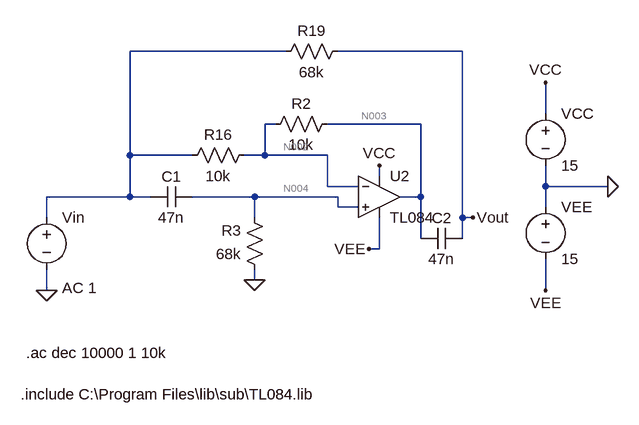
[diagram p0: schematic notch filter.asc]
notch filter.asc, the LTspice schematic file:
Version 4
SHEET 1 1128 680
WIRE 288 -80 48 -80
WIRE 560 -80 368 -80
WIRE 688 16 688 -32
WIRE 272 32 256 32
WIRE 496 32 352 32
WIRE 48 80 48 -80
WIRE 144 80 48 80
WIRE 256 80 256 32
WIRE 256 80 224 80
WIRE 352 80 256 80
WIRE 432 112 432 96
WIRE 352 128 352 80
WIRE 400 128 352 128
WIRE 688 128 688 96
WIRE 784 128 688 128
WIRE 48 144 48 80
WIRE 48 144 -80 144
WIRE 80 144 48 144
WIRE 240 144 144 144
WIRE 368 144 240 144
WIRE 496 144 496 32
WIRE 496 144 464 144
WIRE 368 160 368 144
WIRE 400 160 368 160
WIRE 688 160 688 128
WIRE -80 176 -80 144
WIRE 240 176 240 144
WIRE 560 176 560 -80
WIRE 576 176 560 176
WIRE 496 208 496 144
WIRE 560 208 560 176
WIRE 432 224 432 176
WIRE 432 224 416 224
WIRE 240 272 240 256
WIRE -80 288 -80 256
WIRE 688 288 688 240
FLAG 784 128 0
FLAG 240 272 0
FLAG -80 288 0
FLAG 688 -32 VCC
FLAG 432 96 VCC
FLAG 688 288 VEE
FLAG 416 224 VEE
FLAG 576 176 Vout
SYMBOL res 256 272 R180
WINDOW 0 36 76 Left 2
WINDOW 3 36 40 Left 2
SYMATTR InstName R3
SYMATTR Value 68k
SYMBOL res 368 16 R90
WINDOW 0 0 56 VBottom 2
WINDOW 3 32 56 VTop 2
SYMATTR InstName R2
SYMATTR Value 10k
SYMBOL cap 144 128 R90
WINDOW 0 0 32 VBottom 2
WINDOW 3 32 32 VTop 2
SYMATTR InstName C1
SYMATTR Value 47n
SYMBOL cap 560 192 R90
WINDOW 0 0 32 VBottom 2
WINDOW 3 32 32 VTop 2
SYMATTR InstName C2
SYMATTR Value 47n
SYMBOL voltage -80 160 R0
WINDOW 123 24 124 Left 2
WINDOW 39 0 0 Left 0
SYMATTR Value2 AC 1
SYMATTR InstName Vin
SYMATTR Value ""
SYMBOL voltage 688 144 R0
WINDOW 123 0 0 Left 0
WINDOW 39 0 0 Left 0
SYMATTR InstName VEE
SYMATTR Value 15
SYMBOL voltage 688 0 R0
WINDOW 123 0 0 Left 0
WINDOW 39 0 0 Left 0
SYMATTR InstName VCC
SYMATTR Value 15
SYMBOL res 240 64 R90
WINDOW 0 0 56 VBottom 2
WINDOW 3 32 56 VTop 2
SYMATTR InstName R16
SYMATTR Value 10k
SYMBOL res 384 -96 R90
WINDOW 0 0 56 VBottom 2
WINDOW 3 32 56 VTop 2
SYMATTR InstName R19
SYMATTR Value 68k
SYMBOL OpAmps\\opamp2 432 80 R0
SYMATTR InstName U2
SYMATTR Value TL084
TEXT -112 384 Left 2 !.ac dec 10000 1 10k
TEXT -120 448 Left 2 !.include C:\\Program Files\\lib\\sub\\TL084.lib

The netlist it stands for:
* notch filter.asc
R3 0 N004 68k
R2 N003 N002 10k
C1 N004 N001 47n
C2 Vout N003 47n
Vin N001 0 AC 1
VEE 0 VEE 15
VCC VCC 0 15
R16 N002 N001 10k
R19 Vout N001 68k
XU2 N004 N002 VCC VEE N003 TL084  ; pins In+ In- V+ V- OUT
.ac dec 10000 1 10k
.include C:\Program Files\lib\sub\TL084.lib
.backanno
.end

* Results of the author's LTspice run, read from the files saved beside the schematic
* Operating Point, zero values left out:
*   V(n004) = -3.064 µV
*   V(n003) = 16.26 µV
*   V(n002) = 7.907 µV
*   V(vee) = -15 V
*   V(vcc) = 15 V
*   I(R16) = 790.7 pA
*   I(R2) = 835.8 pA
*   I(R3) = 45.05 pA
*   I(Vcc) = -14.19 mA
*   I(Vee) = -14.19 mA
*   I(Vin) = 790.7 pA
*   Ix(u2:1) = 45.05 pA
*   Ix(u2:2) = 45.05 pA
*   Ix(u2:3) = 14.19 mA
*   Ix(u2:4) = -14.19 mA
*   Ix(u2:5) = -835.8 pA